# Altium schematic sheet WirelessLampReceiver.SchDoc
size A4
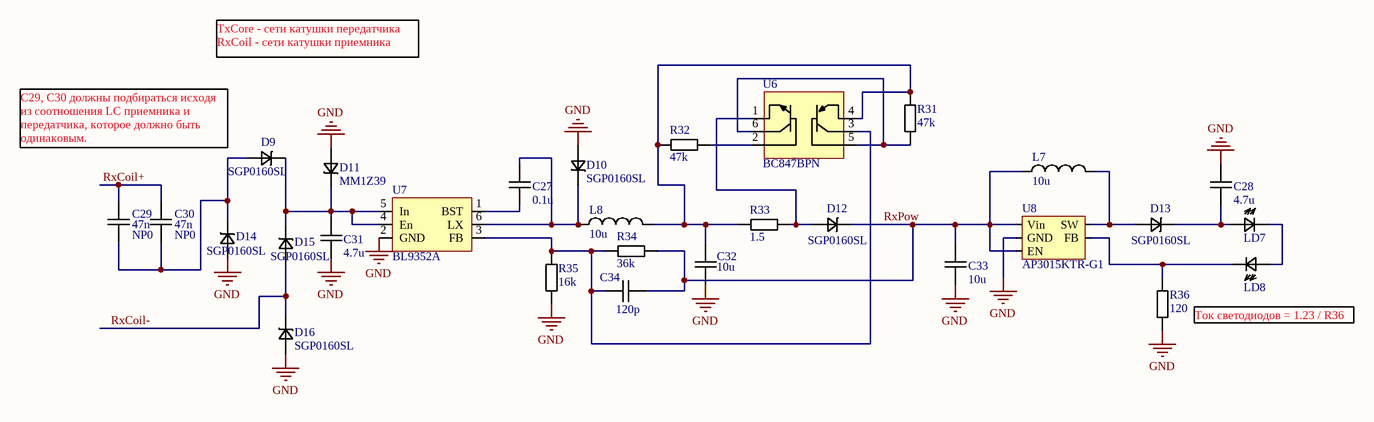
[diagram p0: WirelessLampReceiver.SchDoc]

## Parts
C27  0.1u  [CAPC1608L]
C28  4.7u  [CAPC2012L]
C29  47n  Name: NP0  [CAPC3216L]
C30  47n  Name: NP0  [CAPC3216L]
C31  4.7u  [CAPC3216L]
C32  10u  [CAPC3216L]
C33  10u  [CAPC3216L]
C34  120p  [CAPC1608L]
D9  SGP0160SL  [SOD-323F]
D10  SGP0160SL  [SOD-323F]
D11  MM1Z39  [SOD123]
D12  SGP0160SL  [SOD-323F]
D13  SGP0160SL  [SOD-323F]
D14  SGP0160SL  [SOD-323F]
D15  SGP0160SL  [SOD-323F]
D16  SGP0160SL  [SOD-323F]
L7  10u  [Ind 3x3]
L8  10u  [Ind 3x3]
LD7  LED2825  [LED2835]  (value not drawn)
LD8  LED2825  [LED2835]  (value not drawn)
R31  47k  [RESC1608L]
R32  47k  [RESC1608L]
R33  1.5  [RESC3216L]
R34  36k  [RESC1608L]
R35  16k  [RESC1608L]
R36  120  [RESC2012L]
U6  BC847BPN  [sot-363-6]
U7  BL9352A  [SOT26A-6N]
U8  AP3015KTR-G1  [SOT23-5AL]

## Nets
GND: C28.2 C31.1 C32.1 C33.1 D10.1 D11.1 D14.1 D16.1 R35.1 R36.1 U7.2(GND) U8.2(GND)
RxCoil+: C29.2 C30.1
RxCoil-: D15.1 D16.2
RxPow: C33.2 C34.2 D12.2 L7.1 R34.2 U8.4(EN) U8.5(Vin)
NetC27_1: C27.1 U7.1(BST)
NetC27_2: C27.2 D10.2 L8.1 U7.6(LX)
NetC28_1: C28.1 D13.2 LD7.2
NetC29_1: C29.1 C30.2 D9.1 D14.2
NetC31_2: C31.2 D9.2 D11.2 D15.2 U7.4(En) U7.5(In)
NetC32_2: C32.2 L8.2 R31.2 R32.1 R33.1 U6.4(ep2)
NetC34_1: C34.1 R34.1 R35.2 U6.3(cp2) U7.3(FB)
NetD12_1: D12.1 R33.2 U6.1(en1)
NetD13_1: D13.1 L7.2 U8.1(SW)
NetLD7_1: LD7.1 LD8.2
NetLD8_1: LD8.1 R36.2 U8.3(FB)
NetR31_1: R31.1 U6.5(bp2) U6.6(cn1)
NetR32_2: R32.2 U6.2(bn1)

## Notes on the sheet
- TxCore - сети катушки передатчика
  RxCoil - сети катушки приемника
- (near D9) C29, C30 должны подбираться исходя из соотношения LC приемника и передатчика, которое должно быть одинаковым.
- Ток светодиодов = 1.23 / R36

## Library data of the parts
C27 C28 C32-C34 = Capacitor: Name: *
  C27: Case: 0603; Value: 0.1u
  C28: Case: 1206; Value: 4.7u
  C32 C33: Case: 1206; Value: 10u
  C34: Case: 0603; Value: 120p
C29 C30 = Capacitor: Part: GRM31M5C1H473JA01L; Voltage: 50V; Case: 1206; Value: 47n; LCSC Part: C21812; Link: https://lcsc.com/product-detail/Multilayer-Ceramic-Capacitors-MLCC-SMD-SMT_muRata_GRM31M5C1H473JA01L_47nF-473-10-50V_C21812.html
C31 = Capacitor: Voltage: 50V; Name: *; Case: 1206; Value: 4.7u
D9 D10 D12-D16 = Schotky: Name: SGP0160SL; Case: SOD-323F; Value: *; Part: SGP0160SL; LCSC Part: C110413; Link: https://lcsc.com/product-detail/Schottky-Barrier-Diodes-SBD_SGP0160SL_C110413.html
D11 = Schotky: Value: 39V; Name: MM1Z39; Case: SOD-123; Part: MM1Z39; Link: https://lcsc.com/product-detail/Zener-Diodes_MM1Z39_C107460.html; LCSC Part: C107460
L7 L8 = Inductor: Part: PST031B-100MS; Name: Cyntec PST031B-100MS; Case: SMD,3x3x1.2mm; Value: 10u; Link: https://lcsc.com/product-detail/Inductors-SMD_Cyntec-PST031B-100MS_C218837.html; LCSC Part: C218837
R31-R36 = Resistor: Model: *
  R31 R32: Case: 0603; Value: 47k
  R33: Case: 1206; Value: 1.5
  R34: Case: 0603; Value: 36k
  R35: Case: 0603; Value: 16k
  R36: Case: 0805; Value: 120
U6 = BC847BPN: Part: BC847BPN,115; Name: BC847BPN; Case: SOT-363; LCSC Part: C8655; Link: https://lcsc.com/product-detail/Transistors-NPN-PNP_NXP_BC847BPN_BC847BPN_C8655.html
U7 = BL9352A: StepDown Regulator; Name: BL9352A; LCSC Part: C193985; Part: BL9352A; Link: https://lcsc.com/product-detail/Others_Shanghai-Belling-BL9352A_C193985.html
U8 = TPS6104x: Name: AP3015KTR-G1; Part: AP3015KTR-G1; LCSC Part: C151334; Link: https://lcsc.com/product-detail/DC-DC-Converters_DIODES_AP3015KTR-G1_AP3015KTR-G1_C151334.html